# Altium project cm5_carrier_board.PrjPcb
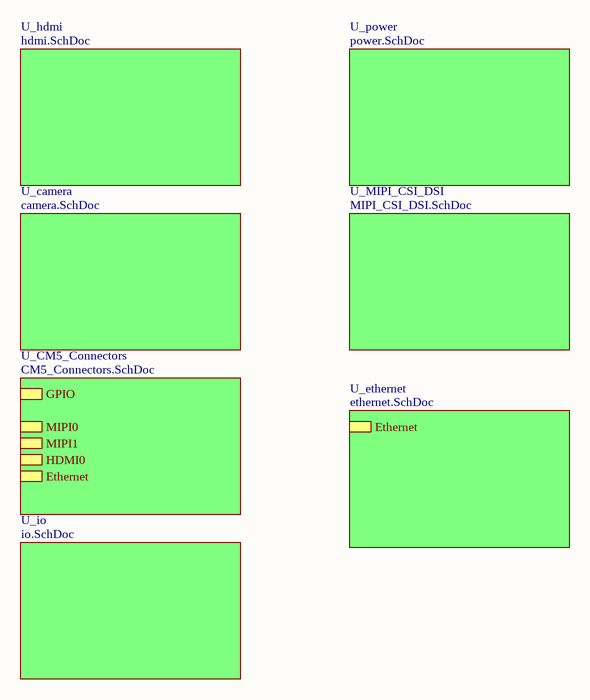
[diagram p0: Overview.SchDoc]
8 sheets, 19 parts. Net scope: hierarchical (ports join the sheet entries above them; power ports are global).
Sheets:
  Overview.SchDoc
    U_hdmi = hdmi.SchDoc
    U_camera = camera.SchDoc
    U_CM5_Connectors = CM5_Connectors.SchDoc
    U_power = power.SchDoc
    U_MIPI_CSI_DSI = MIPI_CSI_DSI.SchDoc
    U_io = io.SchDoc
    U_ethernet = ethernet.SchDoc

## Sheet Overview.SchDoc: Example Template
size A4; CompanyName: University of Manchester; Engineer: Sam Walsh; Organization: University of Manchester; Address1: L3, 12a Rodborough Rd; Address2: Frenchs Forest; Address3: NSW; Address4: Australia 2086; DocumentNumber: 1; Revision: 0; SheetNumber: 1; SheetTotal: 8; Scale: Ratio

### Sub-sheets
U_camera = camera.SchDoc: no entries
U_CM5_Connectors = CM5_Connectors.SchDoc: GPIO, MIPI0 (harness MIPI0), MIPI1 (harness MIPI1), HDMI0 (harness HDMI0), Ethernet (harness Ethernet)
U_ethernet = ethernet.SchDoc: Ethernet (harness Ethernet)
U_hdmi = hdmi.SchDoc: no entries
U_io = io.SchDoc: no entries
U_MIPI_CSI_DSI = MIPI_CSI_DSI.SchDoc: no entries
U_power = power.SchDoc: no entries

### Notes on the sheet
- Size:
- Title
- A4
- Scale:
- NTS
- Revision:
- Designer
- Date:
- Sheet
- of

## Sheet hdmi.SchDoc: Example Template
size A4; CompanyName: University of Manchester; Engineer: Sam Walsh; Organization: University of Manchester; Address1: L3, 12a Rodborough Rd; Address2: Frenchs Forest; Address3: NSW; Address4: Australia 2086; DocumentNumber: 1; Revision: 0; SheetNumber: 3; SheetTotal: 8; Scale: Ratio
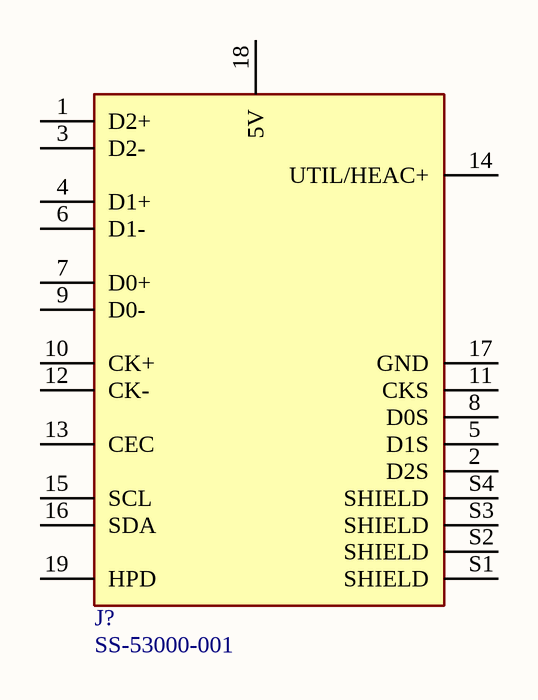
[diagram p1: hdmi.SchDoc]

### Parts
(Parts that share a designator on the sheet are numbered #1, #2 ... from top to bottom, then left to right.)
J?#1  SS-53000-001  [STEWART_SS-53000-001]

### Nets

Not connected (* = marked no-connect by the designer): J?#1 1(D2+) 2(D2S) 3(D2-) 4(D1+) 5(D1S) 6(D1-) 7(D0+) 8(D0S) 9(D0-) 10(CK+) 11(CKS) 12(CK-) 13(CEC) 14(UTIL/HEAC+) 15(SCL) 16(SDA) 17(GND) 18(5V) 19(HPD) S1(SHIELD) S2(SHIELD) S3(SHIELD) S4(SHIELD)

### Notes on the sheet
- Size:
- Title
- A4
- Scale:
- NTS
- Revision:
- Designer
- Date:
- Sheet
- of

### Library data of the parts
J?#1 = SS-53000-001: HDMI Connector | Right Angle | Without Flange | -20C to 85C; Price: None; Value: *; Package: None; Availability: Unavailable; MP: SS-53000-001

## Sheet camera.SchDoc: Example Template
size A4; CompanyName: University of Manchester; Engineer: Sam Walsh; Organization: University of Manchester; Address1: L3, 12a Rodborough Rd; Address2: Frenchs Forest; Address3: NSW; Address4: Australia 2086; DocumentNumber: 1; Revision: 0; SheetNumber: 4; SheetTotal: 4; Scale: Ratio

### Notes on the sheet
- Size:
- Title
- A4
- Scale:
- NTS
- Revision:
- Designer
- Date:
- Sheet
- of

## Sheet CM5_Connectors.SchDoc: Example Template
size A4; CompanyName: University of Manchester; Engineer: Sam Walsh; Organization: University of Manchester; Address1: L3, 12a Rodborough Rd; Address2: Frenchs Forest; Address3: NSW; Address4: Australia 2086; DocumentNumber: 1; Revision: 0; SheetNumber: 7; SheetTotal: 8; Scale: Ratio
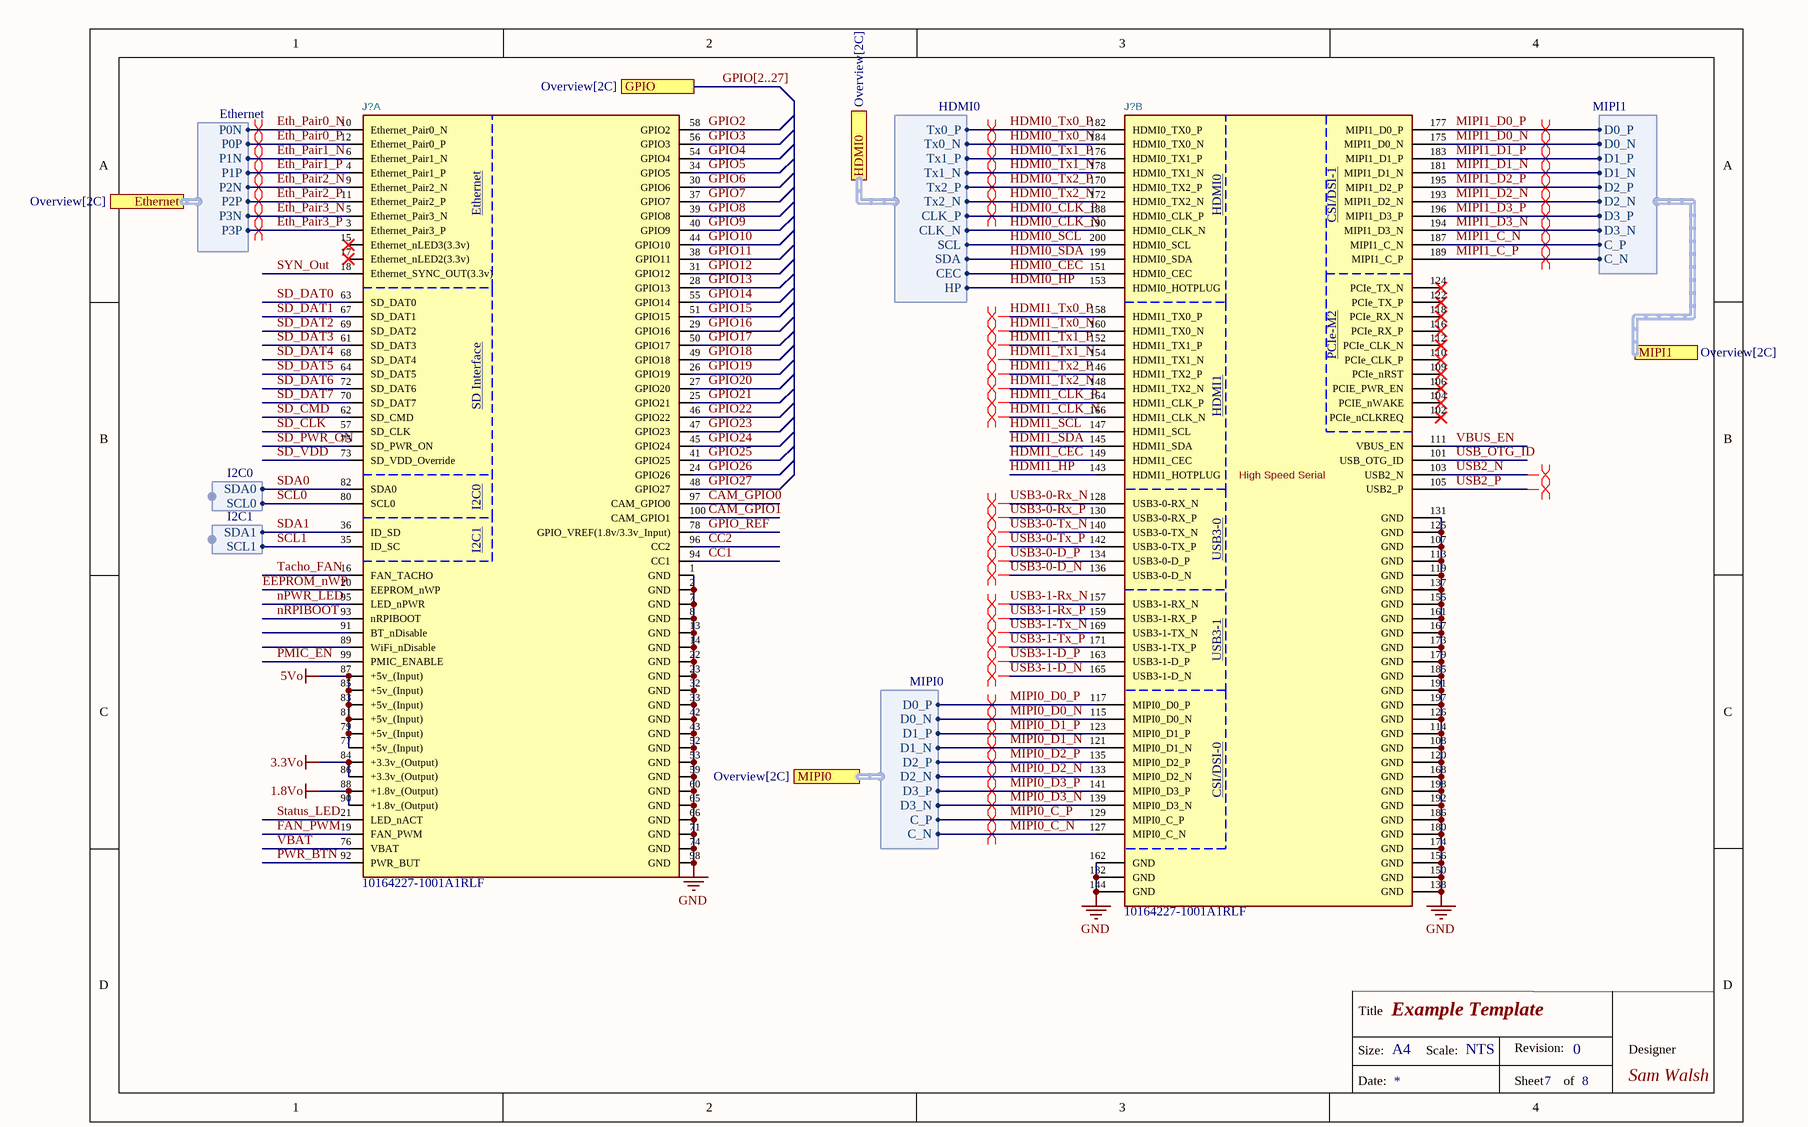
[diagram p2: CM5_Connectors.SchDoc]

### Parts
(Parts that share a designator on the sheet are numbered #1, #2 ... from top to bottom, then left to right.)
J?#2  10164227-1001A1RLF  [Raspberry-Pi-5-Compute-Module]  (part A of 2)
J?#3  10164227-1001A1RLF  [Raspberry-Pi-5-Compute-Module]  (part B of 2)

### Ports
Ethernet (harness Ethernet, see Overview[2C]), GPIO (see Overview[2C]), HDMI0 (harness HDMI0, see Overview[2C]), MIPI0 (harness MIPI0, see Overview[2C]), MIPI1 (harness MIPI1, see Overview[2C])

### Harnesses
MIPI0: D0_P, D0_N, D1_P, D1_N, D2_P, D2_N, D3_P, D3_N, C_P, C_N
MIPI1: D0_P, D0_N, D1_P, D1_N, D2_P, D2_N, D3_P, D3_N, C_P, C_N
HDMI0: Tx0_P, Tx1_N, Tx1_P, Tx2_P, CLK_N, CLK_P, SCL, CEC, HP, Tx2_N, Tx0_N, SDA
I2C0: SDA0, SCL0
I2C1: SDA1, SCL1
Ethernet: P0N, P0P, P1N, P1P, P2N, P2P, P3N, P3P

### Nets
1.8Vo: J?#2.88(+1.8v_(Output)) J?#2.90(+1.8v_(Output))
3.3Vo: J?#2.84(+3.3v_(Output)) J?#2.86(+3.3v_(Output))
5Vo: J?#2.77(+5v_(Input)) J?#2.79(+5v_(Input)) J?#2.81(+5v_(Input)) J?#2.83(+5v_(Input)) J?#2.85(+5v_(Input)) J?#2.87(+5v_(Input))
GND: J?#2.1(GND) J?#2.2(GND) J?#2.7(GND) J?#2.8(GND) J?#2.13(GND) J?#2.14(GND) J?#2.22(GND) J?#2.23(GND) J?#2.32(GND) J?#2.33(GND) J?#2.42(GND) J?#2.43(GND) J?#2.52(GND) J?#2.53(GND) J?#2.59(GND) J?#2.60(GND) J?#2.65(GND) J?#2.66(GND) J?#2.71(GND) J?#2.74(GND) J?#2.98(GND) J?#3.107(GND) J?#3.108(GND) J?#3.113(GND) J?#3.114(GND) J?#3.119(GND) J?#3.120(GND) J?#3.125(GND) J?#3.126(GND) J?#3.131(GND) J?#3.132(GND) J?#3.137(GND) J?#3.138(GND) J?#3.144(GND) J?#3.150(GND) J?#3.155(GND) J?#3.156(GND) J?#3.161(GND) J?#3.162(GND) J?#3.167(GND) J?#3.168(GND) J?#3.173(GND) J?#3.174(GND) J?#3.179(GND) J?#3.180(GND) J?#3.185(GND) J?#3.186(GND) J?#3.191(GND) J?#3.192(GND) J?#3.197(GND) J?#3.198(GND)
CAM_GPIO0: J?#2.97(CAM_GPIO0)
CAM_GPIO1: J?#2.100(CAM_GPIO1)
CC1: J?#2.94(CC1)
CC2: J?#2.96(CC2)
EEPROM_nWP: J?#2.20(EEPROM_nWP)
Eth_Pair0_N: J?#2.10(Ethernet_Pair0_N) ; port Ethernet.P0N
Eth_Pair0_P: J?#2.12(Ethernet_Pair0_P) ; port Ethernet.P0P
Eth_Pair1_N: J?#2.6(Ethernet_Pair1_N) ; port Ethernet.P1N
Eth_Pair1_P: J?#2.4(Ethernet_Pair1_P) ; port Ethernet.P1P
Eth_Pair2_N: J?#2.9(Ethernet_Pair2_N) ; port Ethernet.P2N
Eth_Pair2_P: J?#2.11(Ethernet_Pair2_P) ; port Ethernet.P2P
Eth_Pair3_N: J?#2.5(Ethernet_Pair3_N) ; port Ethernet.P3N
Eth_Pair3_P: J?#2.3(Ethernet_Pair3_P) ; port Ethernet.P3P
FAN_PWM: J?#2.19(FAN_PWM)
GPIO2: J?#2.58(GPIO2)
GPIO3: J?#2.56(GPIO3)
GPIO4: J?#2.54(GPIO4)
GPIO5: J?#2.34(GPIO5)
GPIO6: J?#2.30(GPIO6)
GPIO7: J?#2.37(GPIO7)
GPIO8: J?#2.39(GPIO8)
GPIO9: J?#2.40(GPIO9)
GPIO10: J?#2.44(GPIO10)
GPIO11: J?#2.38(GPIO11)
GPIO12: J?#2.31(GPIO12)
GPIO13: J?#2.28(GPIO13)
GPIO14: J?#2.55(GPIO14)
GPIO15: J?#2.51(GPIO15)
GPIO16: J?#2.29(GPIO16)
GPIO17: J?#2.50(GPIO17)
GPIO18: J?#2.49(GPIO18)
GPIO19: J?#2.26(GPIO19)
GPIO20: J?#2.27(GPIO20)
GPIO21: J?#2.25(GPIO21)
GPIO22: J?#2.46(GPIO22)
GPIO23: J?#2.47(GPIO23)
GPIO24: J?#2.45(GPIO24)
GPIO25: J?#2.41(GPIO25)
GPIO26: J?#2.24(GPIO26)
GPIO27: J?#2.48(GPIO27)
GPIO_REF: J?#2.78(GPIO_VREF(1.8v/3.3v_Input))
HDMI0_CEC: J?#3.151(HDMI0_CEC) ; port HDMI0.CEC
HDMI0_CLK_N: J?#3.190(HDMI0_CLK_N) ; port HDMI0.CLK_N
HDMI0_CLK_P: J?#3.188(HDMI0_CLK_P) ; port HDMI0.CLK_P
HDMI0_HP: J?#3.153(HDMI0_HOTPLUG) ; port HDMI0.HP
HDMI0_SCL: J?#3.200(HDMI0_SCL) ; port HDMI0.SCL
HDMI0_SDA: J?#3.199(HDMI0_SDA) ; port HDMI0.SDA
HDMI0_Tx0_N: J?#3.184(HDMI0_TX0_N) ; port HDMI0.Tx0_N
HDMI0_Tx0_P: J?#3.182(HDMI0_TX0_P) ; port HDMI0.Tx0_P
HDMI0_Tx1_N: J?#3.178(HDMI0_TX1_N) ; port HDMI0.Tx1_N
HDMI0_Tx1_P: J?#3.176(HDMI0_TX1_P) ; port HDMI0.Tx1_P
HDMI0_Tx2_N: J?#3.172(HDMI0_TX2_N) ; port HDMI0.Tx2_N
HDMI0_Tx2_P: J?#3.170(HDMI0_TX2_P) ; port HDMI0.Tx2_P
HDMI1_CEC: J?#3.149(HDMI1_CEC)
HDMI1_CLK_N: J?#3.166(HDMI1_CLK_N)
HDMI1_CLK_P: J?#3.164(HDMI1_CLK_P)
HDMI1_HP: J?#3.143(HDMI1_HOTPLUG)
HDMI1_SCL: J?#3.147(HDMI1_SCL)
HDMI1_SDA: J?#3.145(HDMI1_SDA)
HDMI1_Tx0_N: J?#3.160(HDMI1_TX0_N)
HDMI1_Tx0_P: J?#3.158(HDMI1_TX0_P)
HDMI1_Tx1_N: J?#3.154(HDMI1_TX1_N)
HDMI1_Tx1_P: J?#3.152(HDMI1_TX1_P)
HDMI1_Tx2_N: J?#3.148(HDMI1_TX2_N)
HDMI1_Tx2_P: J?#3.146(HDMI1_TX2_P)
MIPI0_C_N: J?#3.127(MIPI0_C_N) ; port MIPI0.C_N
MIPI0_C_P: J?#3.129(MIPI0_C_P) ; port MIPI0.C_P
MIPI0_D0_N: J?#3.115(MIPI0_D0_N) ; port MIPI0.D0_N
MIPI0_D0_P: J?#3.117(MIPI0_D0_P) ; port MIPI0.D0_P
MIPI0_D1_N: J?#3.121(MIPI0_D1_N) ; port MIPI0.D1_N
MIPI0_D1_P: J?#3.123(MIPI0_D1_P) ; port MIPI0.D1_P
MIPI0_D2_N: J?#3.133(MIPI0_D2_N) ; port MIPI0.D2_N
MIPI0_D2_P: J?#3.135(MIPI0_D2_P) ; port MIPI0.D2_P
MIPI0_D3_N: J?#3.139(MIPI0_D3_N) ; port MIPI0.D3_N
MIPI0_D3_P: J?#3.141(MIPI0_D3_P) ; port MIPI0.D3_P
MIPI1_C_N: J?#3.187(MIPI1_C_N) ; port MIPI1.C_P
MIPI1_C_P: J?#3.189(MIPI1_C_P) ; port MIPI1.C_N
MIPI1_D0_N: J?#3.175(MIPI1_D0_N) ; port MIPI1.D0_N
MIPI1_D0_P: J?#3.177(MIPI1_D0_P) ; port MIPI1.D0_P
MIPI1_D1_N: J?#3.181(MIPI1_D1_N) ; port MIPI1.D1_N
MIPI1_D1_P: J?#3.183(MIPI1_D1_P) ; port MIPI1.D1_P
MIPI1_D2_N: J?#3.193(MIPI1_D2_N) ; port MIPI1.D2_N
MIPI1_D2_P: J?#3.195(MIPI1_D2_P) ; port MIPI1.D2_P
MIPI1_D3_N: J?#3.194(MIPI1_D3_N) ; port MIPI1.D3_N
MIPI1_D3_P: J?#3.196(MIPI1_D3_P) ; port MIPI1.D3_P
nPWR_LED: J?#2.95(LED_nPWR)
nRPIBOOT: J?#2.93(nRPIBOOT)
PMIC_EN: J?#2.99(PMIC_ENABLE)
PWR_BTN: J?#2.92(PWR_BUT)
SCL0: J?#2.80(SCL0) ; harness I2C0.SCL0
SCL1: J?#2.35(ID_SC) ; harness I2C1.SCL1
SD_CLK: J?#2.57(SD_CLK)
SD_CMD: J?#2.62(SD_CMD)
SD_DAT0: J?#2.63(SD_DAT0)
SD_DAT1: J?#2.67(SD_DAT1)
SD_DAT2: J?#2.69(SD_DAT2)
SD_DAT3: J?#2.61(SD_DAT3)
SD_DAT4: J?#2.68(SD_DAT4)
SD_DAT5: J?#2.64(SD_DAT5)
SD_DAT6: J?#2.72(SD_DAT6)
SD_DAT7: J?#2.70(SD_DAT7)
SD_PWR_ON: J?#2.75(SD_PWR_ON)
SD_VDD: J?#2.73(SD_VDD_Override)
SDA0: J?#2.82(SDA0) ; harness I2C0.SDA0
SDA1: J?#2.36(ID_SD) ; harness I2C1.SDA1
Status_LED: J?#2.21(LED_nACT)
SYN_Out: J?#2.18(Ethernet_SYNC_OUT(3.3v))
Tacho_FAN: J?#2.16(FAN_TACHO)
USB2_N: J?#3.103(USB2_N)
USB2_P: J?#3.105(USB2_P)
USB3-0-D_N: J?#3.136(USB3-0-D_N)
USB3-0-D_P: J?#3.134(USB3-0-D_P)
USB3-0-Rx_N: J?#3.128(USB3-0-RX_N)
USB3-0-Rx_P: J?#3.130(USB3-0-RX_P)
USB3-0-Tx_N: J?#3.140(USB3-0-TX_N)
USB3-0-Tx_P: J?#3.142(USB3-0-TX_P)
USB3-1-D_N: J?#3.165(USB3-1-D_N)
USB3-1-D_P: J?#3.163(USB3-1-D_P)
USB3-1-Rx_N: J?#3.157(USB3-1-RX_N)
USB3-1-Rx_P: J?#3.159(USB3-1-RX_P)
USB3-1-Tx_N: J?#3.169(USB3-1-TX_N)
USB3-1-Tx_P: J?#3.171(USB3-1-TX_P)
USB_OTG_ID: J?#3.101(USB_OTG_ID)
VBAT: J?#2.76(VBAT)
VBUS_EN: J?#3.111(VBUS_EN)

Not connected (* = marked no-connect by the designer): J?#2 15(Ethernet_nLED3(3.3v))* 17(Ethernet_nLED2(3.3v))* 89(WiFi_nDisable) 91(BT_nDisable); J?#3 102(PCIe_nCLKREQ)* 104(PCIE_nWAKE)* 106(PCIE_PWR_EN)* 109(PCIe_nRST)* 110(PCIe_CLK_P)* 112(PCIe_CLK_N)* 116(PCIe_RX_P)* 118(PCIe_RX_N)* 122(PCIe_TX_P)* 124(PCIe_TX_N)*

### Buses and harness runs
bus GPIO[2..27] = port GPIO

### Layout directives
differential pair: Eth_Pair0_N, Eth_Pair0_P, Eth_Pair1_N, Eth_Pair1_P, Eth_Pair2_N, Eth_Pair2_P, Eth_Pair3_N, Eth_Pair3_P, HDMI0_CLK_P, HDMI0_Tx0_N, HDMI0_Tx0_P, HDMI0_Tx1_N, HDMI0_Tx1_P, HDMI0_Tx2_N, HDMI0_Tx2_P, HDMI1_CLK_N, HDMI1_CLK_P, HDMI1_Tx0_N, HDMI1_Tx0_P, HDMI1_Tx1_N, HDMI1_Tx1_P, HDMI1_Tx2_N, HDMI1_Tx2_P, MIPI0_C_N, MIPI0_C_P, MIPI0_D0_N, MIPI0_D0_P, MIPI0_D1_N, MIPI0_D1_P, MIPI0_D2_N, MIPI0_D2_P, MIPI0_D3_N, MIPI0_D3_P, MIPI1_C_N, MIPI1_C_P, MIPI1_D0_N, MIPI1_D0_P, MIPI1_D1_N, MIPI1_D1_P, MIPI1_D2_N, MIPI1_D2_P, MIPI1_D3_N, MIPI1_D3_P, USB2_N, USB2_P, USB3-0-D_N, USB3-0-D_P, USB3-0-Rx_N, USB3-0-Rx_P, USB3-0-Tx_N, USB3-0-Tx_P, USB3-1-D_N, USB3-1-D_P, USB3-1-Rx_N, USB3-1-Rx_P, USB3-1-Tx_N, USB3-1-Tx_P

### Notes on the sheet
- Size:
- Title
- A4
- Scale:
- NTS
- Revision:
- Designer
- Date:
- Sheet
- of
- (in symbol ComputeModule5-CM5, part A) Ethernet; SD Interface; I2C0; I2C1
- (in symbol ComputeModule5-CM5, part B) HDMI0; CSI/DSI-1; PCIe-M2; HDMI1; High Speed Serial; USB3-0; USB3-1; CSI/DSI-0

### Library data of the parts
J?#2 J?#3 = ComputeModule5-CM5: RaspberryPi Compute module 5; Footprint: CM5IO:Raspberry-Pi-5-Compute-Module; Mft PN: 10164227-1001A1RLF; Description_: RaspberryPi Compute module 5

## Sheet power.SchDoc: Example Template
size A4; CompanyName: University of Manchester; Engineer: Sam Walsh; Organization: University of Manchester; Address1: L3, 12a Rodborough Rd; Address2: Frenchs Forest; Address3: NSW; Address4: Australia 2086; DocumentNumber: 1; Revision: 0; SheetNumber: 2; SheetTotal: 2; Scale: Ratio

### Notes on the sheet
- Size:
- Title
- A4
- Scale:
- NTS
- Revision:
- Designer
- Date:
- Sheet
- of

## Sheet MIPI_CSI_DSI.SchDoc: Example Template
size A4; CompanyName: University of Manchester; Engineer: Sam Walsh; Organization: University of Manchester; Address1: L3, 12a Rodborough Rd; Address2: Frenchs Forest; Address3: NSW; Address4: Australia 2086; DocumentNumber: 1; Revision: 0; SheetNumber: 8; SheetTotal: 8; Scale: Ratio
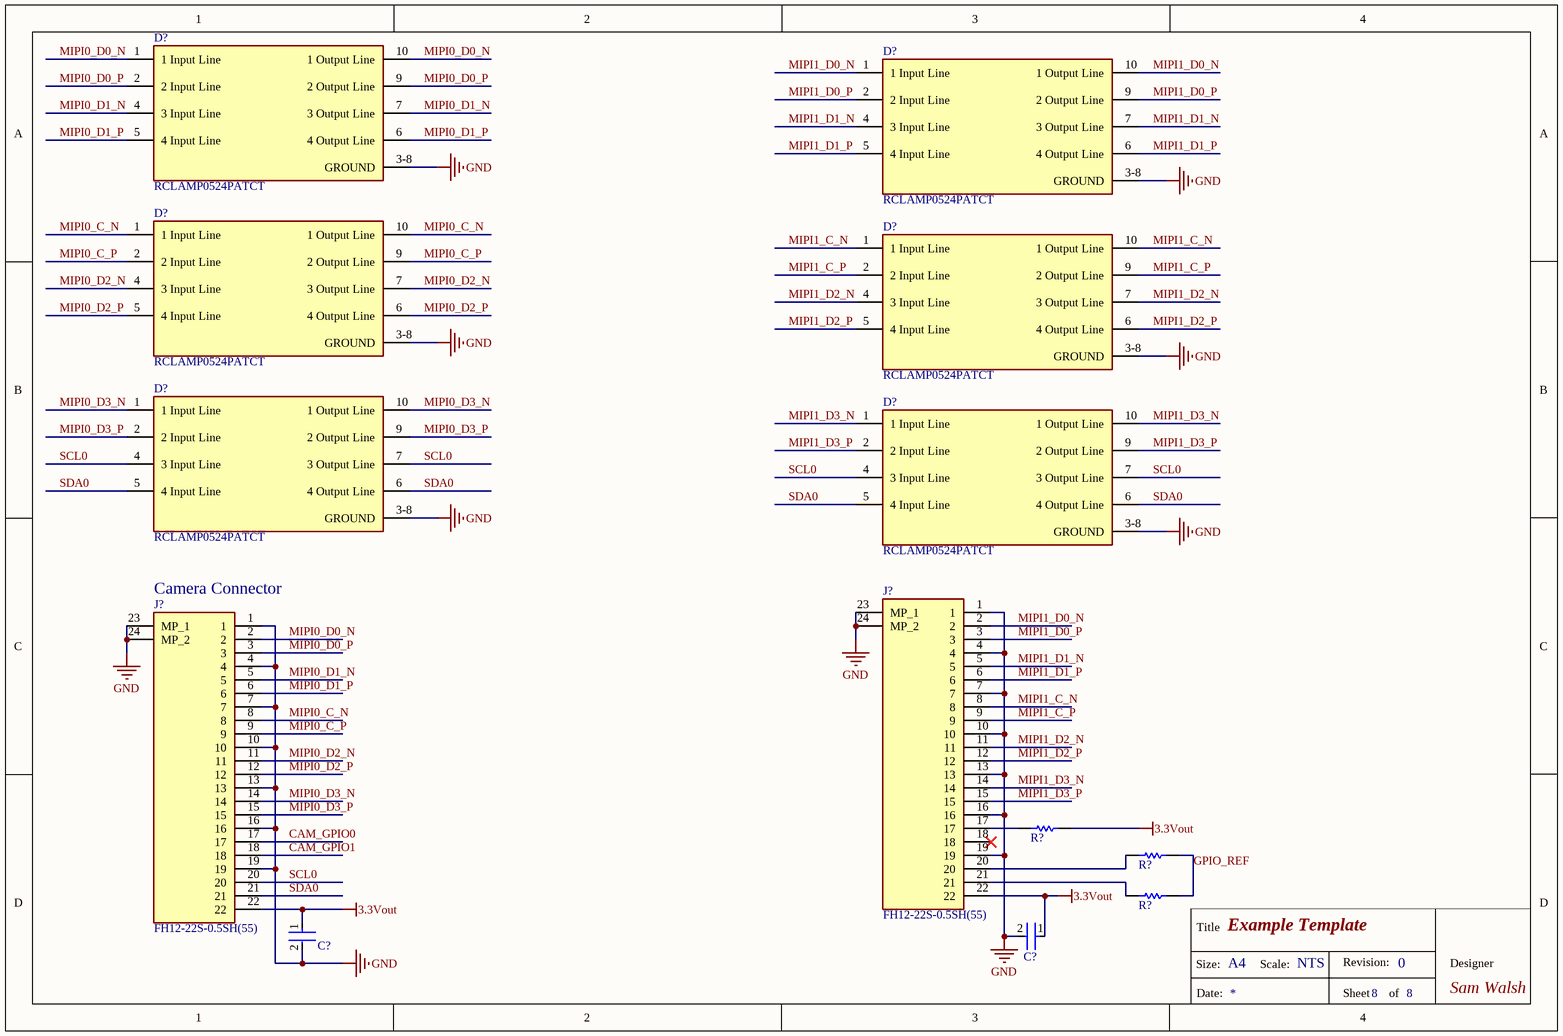
[diagram p3: MIPI_CSI_DSI.SchDoc]

### Parts
(Parts that share a designator on the sheet are numbered #1, #2 ... from top to bottom, then left to right.)
C?#1  CGA3E2X7R1H473M080AD  [FP-CGA3E-0_3-0_1-MFG]  (value not drawn)
C?#2  CGA3E2X7R1H473M080AD  [FP-CGA3E-0_3-0_1-MFG]  (value not drawn)
D?#1  RCLAMP0524PATCT  [FP-SLP2510P8-MFG]
D?#2  RCLAMP0524PATCT  [FP-SLP2510P8-MFG]
D?#3  RCLAMP0524PATCT  [FP-SLP2510P8-MFG]
D?#4  RCLAMP0524PATCT  [FP-SLP2510P8-MFG]
D?#5  RCLAMP0524PATCT  [FP-SLP2510P8-MFG]
D?#6  RCLAMP0524PATCT  [FP-SLP2510P8-MFG]
J?#4  FH12-22S-0.5SH(55)  [FH1222S05SH55]
J?#5  FH12-22S-0.5SH(55)  [FH1222S05SH55]
R?#1  RK73H1JTTD2151F  [RESC1608X55X30ML20T10]  (value not drawn)
R?#2  RK73H1JTTD2151F  [RESC1608X55X30ML20T10]  (value not drawn)
R?#3  RK73H1JTTD2151F  [RESC1608X55X30ML20T10]  (value not drawn)

### Nets
3.3Vout: C?#1.1 C?#2.1 J?#4.22 J?#5.22 R?#1.2
GND: C?#1.2 C?#2.2 D?#1.3-8(GROUND) D?#2.3-8(GROUND) D?#3.3-8(GROUND) D?#4.3-8(GROUND) D?#5.3-8(GROUND) D?#6.3-8(GROUND) J?#4.1 J?#4.4 J?#4.7 J?#4.10 J?#4.13 J?#4.16 J?#4.19 J?#4.23(MP_1) J?#4.24(MP_2) J?#5.1 J?#5.4 J?#5.7 J?#5.10 J?#5.13 J?#5.16 J?#5.19 J?#5.23(MP_1) J?#5.24(MP_2)
CAM_GPIO0: J?#5.17
CAM_GPIO1: J?#5.18
GPIO_REF: R?#2.2 R?#3.2
MIPI0_C_N: D?#3.1(1_Input_Line) D?#3.10(1_Output_Line) J?#5.8
MIPI0_C_P: D?#3.2(2_Input_Line) D?#3.9(2_Output_Line) J?#5.9
MIPI0_D0_N: D?#1.1(1_Input_Line) D?#1.10(1_Output_Line) J?#5.2
MIPI0_D0_P: D?#1.2(2_Input_Line) D?#1.9(2_Output_Line) J?#5.3
MIPI0_D1_N: D?#1.4(3_Input_Line) D?#1.7(3_Output_Line) J?#5.5
MIPI0_D1_P: D?#1.5(4_Input_Line) D?#1.6(4_Output_Line) J?#5.6
MIPI0_D2_N: D?#3.4(3_Input_Line) D?#3.7(3_Output_Line) J?#5.11
MIPI0_D2_P: D?#3.5(4_Input_Line) D?#3.6(4_Output_Line) J?#5.12
MIPI0_D3_N: D?#5.1(1_Input_Line) D?#5.10(1_Output_Line) J?#5.14
MIPI0_D3_P: D?#5.2(2_Input_Line) D?#5.9(2_Output_Line) J?#5.15
MIPI1_C_N: D?#4.1(1_Input_Line) D?#4.10(1_Output_Line) J?#4.8
MIPI1_C_P: D?#4.2(2_Input_Line) D?#4.9(2_Output_Line) J?#4.9
MIPI1_D0_N: D?#2.1(1_Input_Line) D?#2.10(1_Output_Line) J?#4.2
MIPI1_D0_P: D?#2.2(2_Input_Line) D?#2.9(2_Output_Line) J?#4.3
MIPI1_D1_N: D?#2.4(3_Input_Line) D?#2.7(3_Output_Line) J?#4.5
MIPI1_D1_P: D?#2.5(4_Input_Line) D?#2.6(4_Output_Line) J?#4.6
MIPI1_D2_N: D?#4.4(3_Input_Line) D?#4.7(3_Output_Line) J?#4.11
MIPI1_D2_P: D?#4.5(4_Input_Line) D?#4.6(4_Output_Line) J?#4.12
MIPI1_D3_N: D?#6.1(1_Input_Line) D?#6.10(1_Output_Line) J?#4.14
MIPI1_D3_P: D?#6.2(2_Input_Line) D?#6.9(2_Output_Line) J?#4.15
SCL0: D?#5.4(3_Input_Line) D?#5.7(3_Output_Line) D?#6.4(3_Input_Line) D?#6.7(3_Output_Line) J?#5.20
SDA0: D?#5.5(4_Input_Line) D?#5.6(4_Output_Line) D?#6.5(4_Input_Line) D?#6.6(4_Output_Line) J?#5.21
NetJ?#4_17: J?#4.17 R?#1.1
NetJ?#4_20: J?#4.20 R?#2.1
NetJ?#4_21: J?#4.21 R?#3.1

Not connected (* = marked no-connect by the designer): J?#4 18*

### Notes on the sheet
- (near J?#5) Camera Connector
- Size:
- Title
- A4
- Scale:
- NTS
- Revision:
- Designer
- Date:
- Sheet
- of

### Library data of the parts
C?#1 C?#2 = CMP-08246-002396-1: Cap Ceramic 47nF 50V X7R 20% Pad SMD 0603 +125°C Automotive T/R; Package Quantity: 4000; Dielectric: X7R; Capacitance: 47nF; Weight: 7.1E-05oz; Packaging: Tape and Reel; Mount: Surface Mount; Width: 0.8mm; Thickness: 0.031inch; Case Code (Metric): 1608; Tolerance: 20%; Height: 0.8mm; Min Operating Temperature: -55°C; Case/Package: 0603; Voltage Rating: 50V; Length: 0.063inch; Max Operating Temperature: 125°C; Voltage Rating (DC): 50V; Ratings: AEC-Q200; Case Code (Imperial): 0603
D?#1-D?#6 = CMP-56445-000006-1: TVS DIODE 5V 15V SLP2510P8; Number of Unidirectional Channels: 4; Min Breakdown Voltage: 6V; Direction: Unidirectional; Power Line Protection: Yes; Peak Pulse Power: 150W; Leakage Current: 1uA; Capacitance: 0.8pF; Peak Pulse Current: 1A; Series: RailClamp®; Min Operating Temperature: -55°C; Number of Bidirectional Channels: 4; Mount: Surface Mount; Clamping Voltage: 15V; Clamping Voltage-Max: 15V; Max Operating Temperature: 125°C; Working Voltage: 5V; Case/Package: SMD/SMT; Packaging: Tape and Reel; RoHS Compliant: Yes; Reverse Standoff Voltage: 5V; Radiation Hardening: No; Number of Pins: 10; Depth: 1mm; Length: 2.5mm
J?#4 J?#5 = FH12-22S-0.5SH_55: CONN FFC BOTTOM 22POS 0.5MM R/A; Manufacturer_Name: Hirose; Geometry.Height: 2.2mm; Mouser Part Number: 798-FH12-22S-0.5SH55; Mouser Price/Stock: https://www.mouser.co.uk/ProductDetail/Hirose-Connector/FH12-22S-0.5SH55?qs=Ux3WWAnHpjDjN9JNAugKTA%3D%3D; Manufacturer_Part_Number: FH12-22S-0.5SH(55); Datasheet Link: https://www.hirose.com/en/product/document?clcode=CL0586-0532-7-55&productname=FH12-22S-0.5SH(55)&series=FH12&documenttype=2DDrawing&lang=en&documentid=0000987484
R?#1-R?#3 = CMP-2000-01299-1: Manufacturer: KOA Speer; Part Number: RK73H1JTTD2151F

## Sheet io.SchDoc: Example Template
size A4; CompanyName: University of Manchester; Engineer: Sam Walsh; Organization: University of Manchester; Address1: L3, 12a Rodborough Rd; Address2: Frenchs Forest; Address3: NSW; Address4: Australia 2086; DocumentNumber: 1; Revision: 0; SheetNumber: 6; SheetTotal: 6; Scale: Ratio

### Notes on the sheet
- Size:
- Title
- A4
- Scale:
- NTS
- Revision:
- Designer
- Date:
- Sheet
- of

## Sheet ethernet.SchDoc: Example Template
size A4; CompanyName: University of Manchester; Engineer: Sam Walsh; Organization: University of Manchester; Address1: L3, 12a Rodborough Rd; Address2: Frenchs Forest; Address3: NSW; Address4: Australia 2086; DocumentNumber: 1; Revision: 0; SheetNumber: 5; SheetTotal: 8; Scale: Ratio
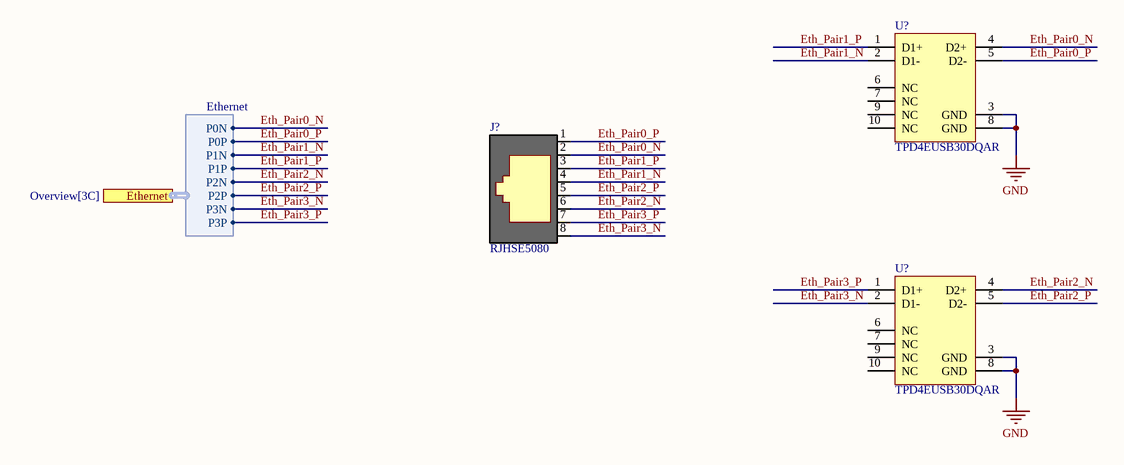
[diagram p4: ethernet.SchDoc]

### Parts
(Parts that share a designator on the sheet are numbered #1, #2 ... from top to bottom, then left to right.)
J?#6  RJHSE5080  [AMPHENOL_RJHSE-5080]
U?#1  TPD4EUSB30DQAR  [DQA0010A_V]
U?#2  TPD4EUSB30DQAR  [DQA0010A_V]

### Ports
Ethernet (harness Ethernet, see Overview[3C])

### Harnesses
Ethernet: P0N, P0P, P1N, P1P, P2N, P2P, P3N, P3P

### Nets
GND: U?#1.3(GND) U?#1.8(GND) U?#2.3(GND) U?#2.8(GND)
Eth_Pair0_N: J?#6.2(1-) U?#1.4(D2+) ; port Ethernet.P0N
Eth_Pair0_P: J?#6.1(1+) U?#1.5(D2-) ; port Ethernet.P0P
Eth_Pair1_N: J?#6.4(2-) U?#1.2(D1-) ; port Ethernet.P1N
Eth_Pair1_P: J?#6.3(2+) U?#1.1(D1+) ; port Ethernet.P1P
Eth_Pair2_N: J?#6.6(3-) U?#2.4(D2+) ; port Ethernet.P2N
Eth_Pair2_P: J?#6.5(3+) U?#2.5(D2-) ; port Ethernet.P2P
Eth_Pair3_N: J?#6.8(4-) U?#2.2(D1-) ; port Ethernet.P3N
Eth_Pair3_P: J?#6.7(4+) U?#2.1(D1+) ; port Ethernet.P3P

Not connected (* = marked no-connect by the designer): U?#1 6(NC) 7(NC) 9(NC) 10(NC); U?#2 6(NC) 7(NC) 9(NC) 10(NC)

### Notes on the sheet
- Size:
- Title
- A4
- Scale:
- NTS
- Revision:
- Designer
- Date:
- Sheet
- of

### Library data of the parts
J?#6 = RJHSE-5080: CONN MOD JACK 8P8C R/A UNSHLD; Manufacturer: Amphenol; Contact Resistance: 20mR; Gender: Female; Number of Positions: 8; Max Current Rating: 1.5A; Pitch: 2.03mm; Voltage Rating (DC): 125V; Connector Type: RJ45; Manufacturer Part Number: RJHSE5080; Contact Plating: Gold; Orientation: Right Angle; Mounting Technology: Through Hole,Panel; Lead Free: Lead Free; RoHS Compliant: Yes; Depth: 14.99mm; Length: 15.75mm
U?#1 U?#2 = CMP-0326-00027-3: ESD Solution for Super-Speed (6 GBPS) USB 3.0 Interface, 4 Channels, -40 to +85 degC, 10-pin SON (DQA), Green (RoHS & no Sb/Br); Manufacturer: Texas Instruments; Differential Capacitance(pF): 0.05; Serial ATA / eSATA: TRUE; IO Capacitance(Typ)(pF): 0.8; IO Leakage Current(nA): 10; IEC 61000-4-2 Air-Gap(+/- kV): 8; ComponentLink3Description: URL Link1; PartNumber: TPD4EUSB30DQAR; DatasheetVersion: SLVSAC2C; ComponentLink2URL: http://www.ti.com/general/docs/lit/getliterature.tsp?genericPartNumber=TPD4EUSB30&fileType=pdf; USB Super Speed: TRUE; Eco-Plan: Green (RoHS & no Sb/Br); Mounting Technology: Surface Mount; 1394 / Firewire: TRUE; PackageVersion: revB, Sep-2009; SubFamily: ESD Solution; USB Full Speed: TRUE; USB High Speed: TRUE; ComponentLink2Description: Datasheet; ComponentLink1URL: http://www.ti.com/; IEC 61000-4-2 Contact(+/- kV): 8; Breakdown Voltage(Min)(V): 8; PackageReference: DQA0010A; ComponentLink1Description: Manufacturer URL; PackageDescription: 10-Pin Plastic Small Outline No-Lead, 1 x 2.5 x 0.55 mm Body, 0.5 mm Pitch; ComponentLink3URL: SamplesURL:http://www.ti.com/product/tpd4eusb30#samples; HDMI: TRUE

## Nets that join several sheets
GND: CM5_Connectors (51 pins), MIPI_CSI_DSI (26 pins), ethernet (U?#1.3 U?#1.8 U?#2.3 U?#2.8)